# Altium schematic sheet Main Schematic.SchDoc
size A4; PageSetup: Record=PageOptions|CenterHorizontal=True|CenterVertical=True|PrintScale=0.49|XCorrection=1.00|YCorrection=1.00|PrintKind=1|BorderSize=5000000|LeftOffset=0|BottomOffset=0|Orientation=2|PaperLength=1000|PaperWidth=1000|Scale=100|PaperSource=15|PrintQuality=1200|MediaType=1|DitherType=10|PrintScaleMode=1|PaperKind=Letter|PaperIndex=1; SheetNumber: 1; SheetTotal: 7
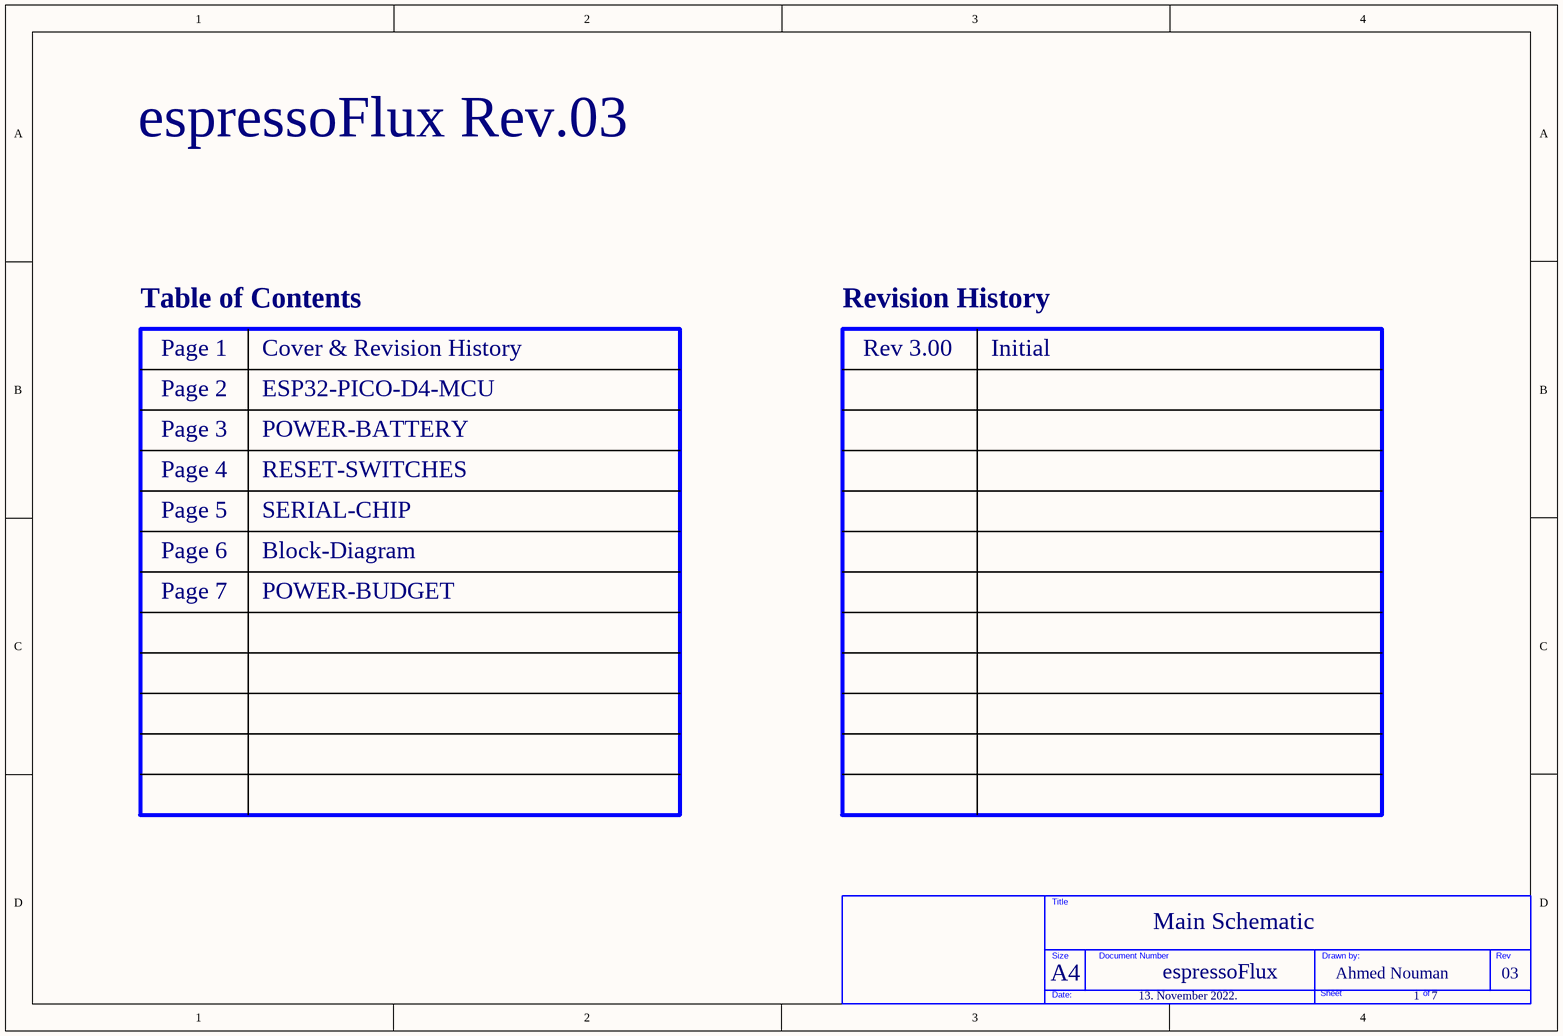
[diagram p0: Main Schematic.SchDoc]

## Parts
?  (no value)  (graphical)

## Notes on the sheet
- espressoFlux Rev.03
- Table of Contents
- Revision History
- Page 1
- Cover & Revision History
- Rev 3.00
- Initial
- Page 2
- Page 3
- ESP32-PICO-D4-MCU
- POWER-BATTERY
- Page 4
- Page 5
- RESET-SWITCHES
- SERIAL-CHIP
- Page 6
- Block-Diagram
- Page 7
- POWER-BUDGET
- A4
- Main Schematic
- espressoFlux
- Ahmed Nouman
- 03
- 13. November 2022.
- 1    7
- Title
- Size
- Document Number
- Drawn by:
- Rev
- Date:
- Sheet
- of

## Library data of the parts
? = TITLE BLOCK_BLANK